# EAGLE design ai_breakout_ads1115 (EAGLE 7.1.0)
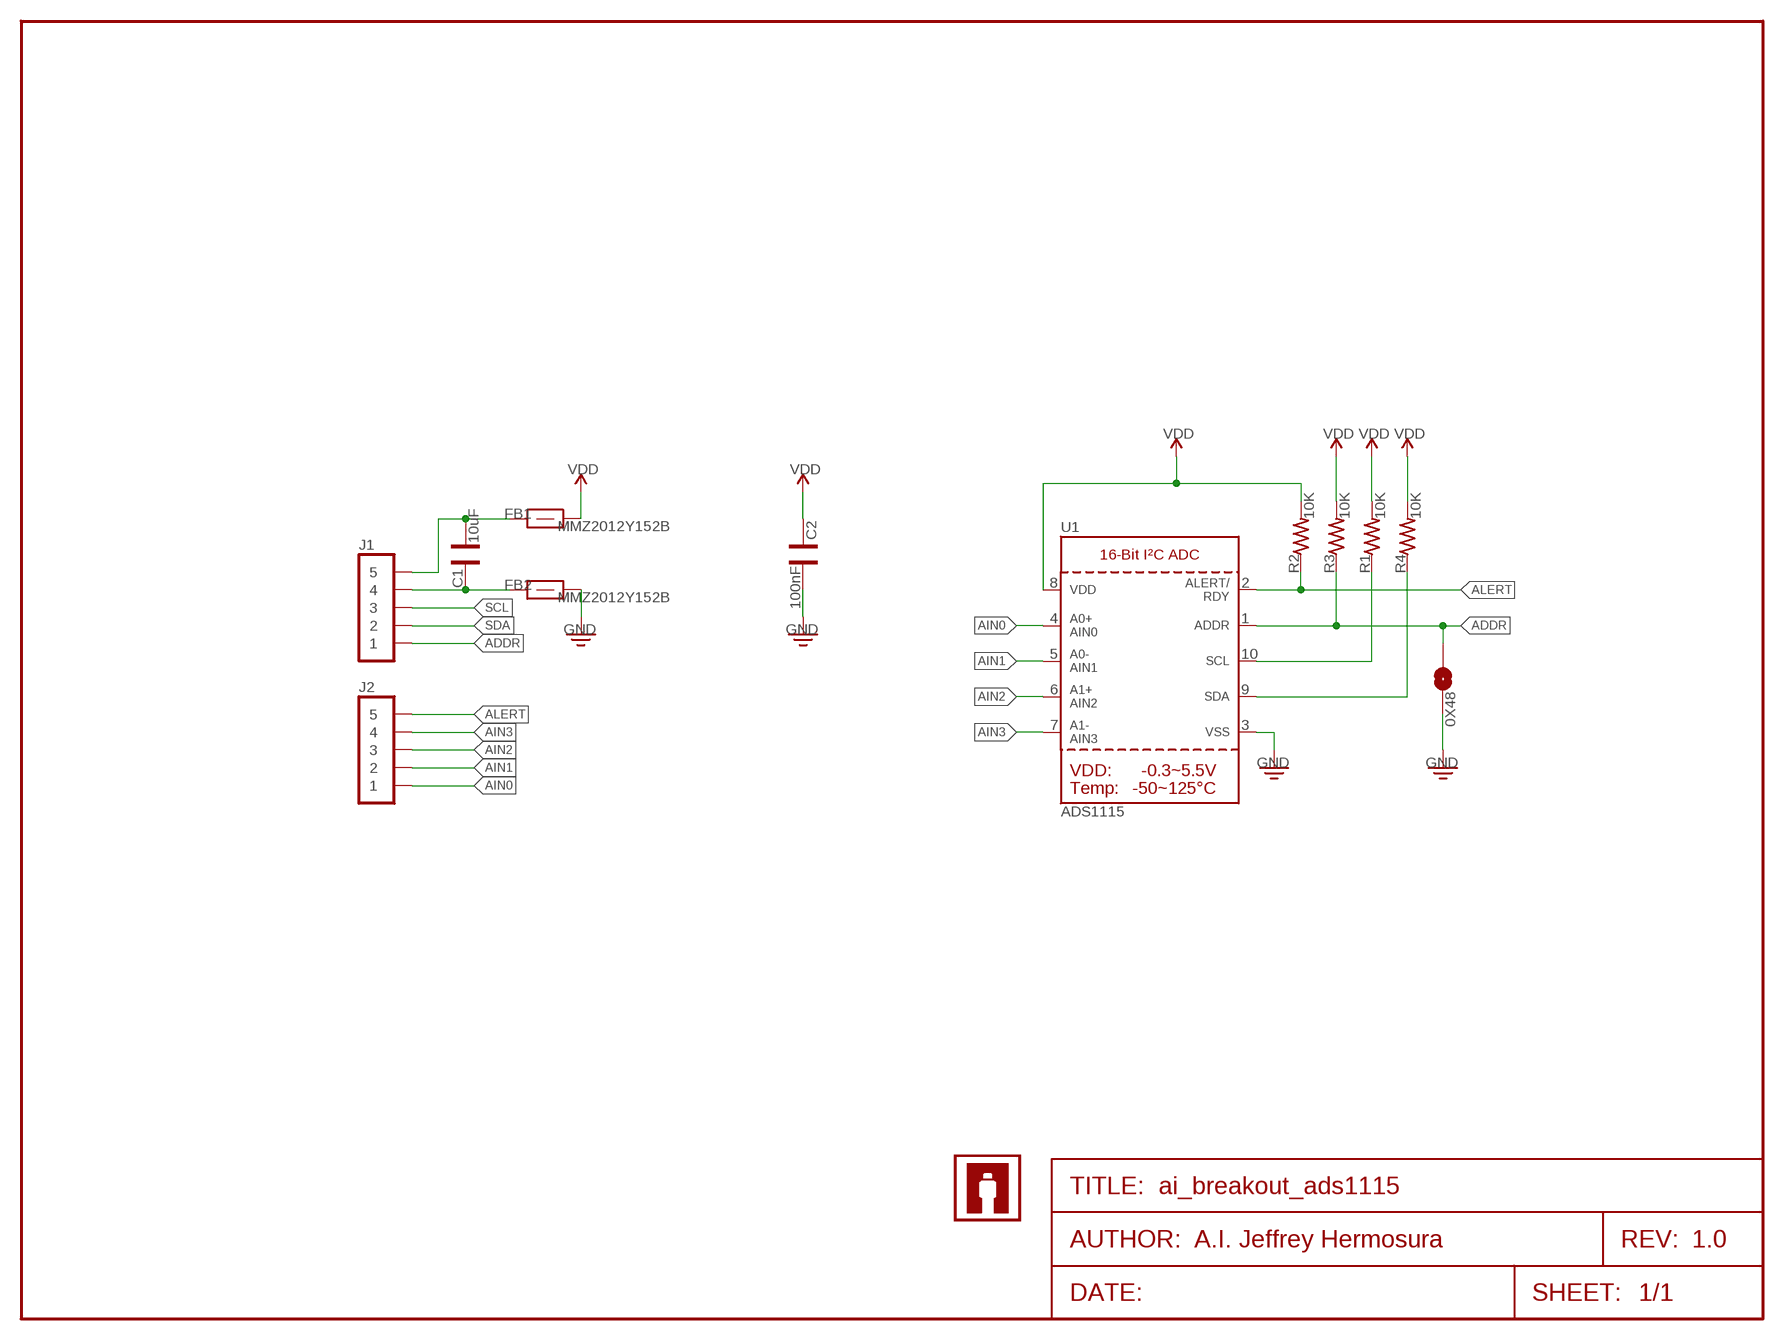
[diagram p0: schematic, sheet 1]
FRAME1 (FRAME-LETTER): AUTHOR: A.I. Jeffrey Hermosura; REV: 1.0

## Parts
0X48  1X02-SJ-NO  [1X02-SJ-NO]
C1  10uF  CAP0603  [CAP-0603]
C2  100nF  CAP0603  [CAP-0603]
FB1  MMZ2012Y152B  FB  [FB-0603]
FB2  MMZ2012Y152B  FB  [FB-0603]
J1  1X05  [1X05]
J2  1X05NOFIRST  [1X05-NOFIRST]
R1  10K  RES0603  [RES-0603]
R2  10K  RES0603  [RES-0603]
R3  10K  RES0603  [RES-0603]
R4  10K  RES0603  [RES-0603]
U1  ADS1115  [MSOP10]
U$2  AI-LOGOXS  [AI-LOGO-XS]

## Nets
ADDR: 0X48.1 J1.1 R3.1 U1.1(ADDR)
AIN0: J2.1 U1.4(AIN0)
AIN1: J2.2 U1.5(AIN1)
AIN2: J2.3 U1.6(AIN2)
AIN3: J2.4 U1.7(AIN3)
ALERT: J2.5 R2.1 U1.2(ALERT/RDY)
GND: 0X48.2 C2.1 FB2.2 U1.3(VSS)
N$3: C1.1 FB1.1 J1.5
N$4: C1.2 FB2.1 J1.4
SCL: J1.3 R1.1 U1.10(SCL)
SDA: J1.2 R4.1 U1.9(SDA)
VDD: C2.2 FB1.2 R1.2 R2.2 R3.2 R4.2 U1.8(VDD)

## Library data of the parts
0X48 = Ai_Connectors:1X02-SJ-NO: A.I. Device 1x02-SJ-* NC has a large amount of paste (see paste layer) so that it should jumper during reflow. Remember that we have a version with a buil-in trace, which needs to be cut in order to have the jumper be NO.
C1 C2 = Ai_Passives:CAP
FB1 FB2 = Ai_Passives:FB: Ferrite bead
J1 J2 = Ai_Connectors:1X05
R1-R4 = Ai_Passives:RES: Part # blah Digikey
U1 = Ai_IC:ADS1115: 16-Bit Del-Sig ADC Four single-ended inputs or two differential inputs Internal PGA I2C interface 2.0-5.5V
U$2 = Ai_Miscellany:AI-LOGO

## Board
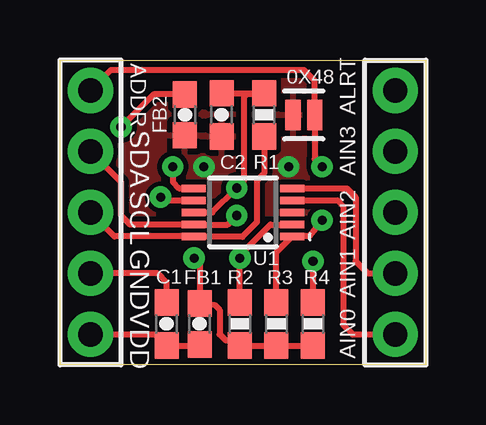
[diagram p1: board, top side]
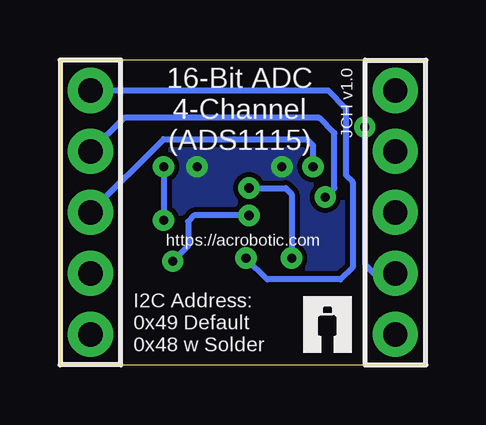
[diagram p2: board, bottom side, seen from below]

Size 15.24 x 12.7 mm. Coordinates in mm from the lower left corner, seen from the top.
Outline: 0,12.7 15.24,12.7 15.24,0 0,0 0,12.7
Copper layers (1*16): Top 0.035mm / dielectric 1.5mm / Bottom 0.035mm
Design rules "ai_2layer": minimum track width 7mil, minimum drill 15mil, track to track 8mil, track to pad 8mil, pad to pad 8mil, via to via 8mil, smd to smd 8mil, copper to edge 8mil, drill to drill 8mil, minimum pad ring 12mil, minimum via ring 10mil, stop-mask expansion 4mil, vias tented up to drill 20mil, thermal gap 10mil

### Footprints (pad centres in the part's own frame; a part is rotated, then mirrored left to right if it is on the bottom)
1X02-SJ-NO = smd 0.635 x 1.27: 1 -0.45,0; 2 0.45,0
CAP-0603 = smd 1.1 x 1: 1 -0.9,0; 2 0.9,0
FB-0603 = smd 1.1 x 1: 1 -0.85,0; 2 0.85,0
1X05 = drill 1.016 pad 1.88: 1 -5.08,0; 2 -2.54,0; 3 0,0; 4 2.54,0; 5 5.08,0
1X05-NOFIRST = drill 1.016 pad 1.88: 1 -5.08,0; 2 -2.54,0; 3 0,0; 4 2.54,0; 5 5.08,0
RES-0603 = smd 1.1 x 1: 1 -0.9,0; 2 0.9,0
MSOP10 = smd 0.3 x 1: 1 -1,-2.05; 2 -0.5,-2.05; 3 0,-2.05; 4 0.5,-2.05; 5 1,-2.05; 6 1,2.05; 7 0.5,2.05; 8 0,2.05; 9 -0.5,2.05; 10 -1,2.05

### Placement (x,y rotation side)
0X48  10.16,10.41 180 top
C1  4.45,1.7 90 top
C2  6.73,10.41 90 top
FB1  5.82,1.7 90 top
FB2  5.21,10.41 270 top
J1  1.27,6.35 270 top
J2  13.97,6.35 90 top
R1  8.51,10.41 90 top
R2  7.49,1.7 270 top
R3  9.02,1.7 270 top
R4  10.54,1.7 270 top
U1  7.62,6.35 90 top
U$2  5.08,0.51 0 bottom

### Tracks (layer width: path | path; a pad name or v marks a point on that pad's centre or on a via)
ADDR  (via drill 0.38)
  Top 0.254: J1.1 2.13,12.29 10.16,12.29 10.61,11.84 0X48.1 10.61,8.57 v10.92,8.26 | R3.1 9.02,4.7 U1.1 10.38,5.35 v10.92,6.02
  Bottom 0.254: v10.92,8.26 v10.92,6.02
AIN0
  Top 0.254: U1.4 11.56,6.85 11.81,6.6 11.81,1.65 12.19,1.27 J2.1
AIN1
  Top 0.254: U1.5 11.95,7.35 12.32,6.99 12.32,4.32 12.83,3.81 J2.2
AIN2  (via drill 0.38)
  Top 0.254: v4.7,8.26 4.7,7.62 4.95,7.37 5.55,7.37 U1.6
  Bottom 0.254: J2.3 10.92,9.4 4.95,9.4 4.7,9.14 v4.7,8.26
AIN3  (via drill 0.38)
  Top 0.254: v4.19,6.99 4.32,6.86 U1.7
  Bottom 0.254: J2.4 12.57,10.29 4.45,10.29 3.81,9.65 3.81,7.37 v4.19,6.99
ALERT  (via drill 0.38)
  Top 0.254: R2.1 v7.49,4.45 7.49,4.57 8.76,5.84 U1.2
  Bottom 0.254: J2.5 4.06,11.43 3.33,10.69 3.33,7.9 3.05,7.62 3.05,4.06 3.56,3.56 6.6,3.56 v7.49,4.45
GND  (via drill 0.38)
  other vias: 9.53,8.26 5.99,8.26
  pour Top: 0,0 15.24,0 15.24,12.7 0,12.7
  pour Bottom: 0,12.7 15.24,12.7 15.24,0 0,0
N$3
  Top 0.254: J1.5 3.93,1.27 C1.1 5.79,0.8 FB1.1
N$4  (via drill 0.38)
  Top 0.254: C1.2 4.45,3.43 4.06,3.81 J1.4 | FB2.1 3.9,11.26 v2.54,9.91
  Bottom 0.254: v2.54,9.91 2.54,4.19 2.16,3.81 J1.4
SCL
  Top 0.254: J1.3 2.27,5.35 U1.10 5.59,5.33 7.59,5.33 8.2,5.94 8.2,7.67 8.51,7.98 R1.1
SDA  (via drill 0.38)
  Top 0.254: J1.2 2.54,7.62 2.54,6.22 2.91,5.85 U1.9 6.99,5.84 v7.37,6.22 | v10.54,4.32 R4.1
  Bottom 0.254: v7.37,6.22 9.65,6.22 9.91,5.97 9.91,4.95 v10.54,4.32
VDD  (via drill 0.38)
  Top 0.254: R4.2 R3.2 R2.2 7.48,1.02 6.91,1.02 6.66,1.27 6.66,2.29 6.44,2.5 FB1.2 5.84,2.78 5.84,4.19 v5.59,4.45 | C2.2 R1.2 8.5,11.3 7.8,11.3 7.67,11.18 7.67,7.67 v7.37,7.37 6.35,6.35 U1.8 6.33,6.35
  Bottom 0.254: v7.37,7.37 5.84,7.37 5.59,7.11 v5.59,4.45

### Text on the board
tNames: ADDR | SDA | ALRT | AIN3 | SCL | GND | AIN2 | AIN1 | VDD | AIN0
bNames: JCH v1.0 | 16-Bit ADC / 4-Channel / (ADS1115) | https://acrobotic.com | I2C Address: / 0x49 Default / 0x48 w Solder